# Altium schematic sheet DDR_MIO_Banks.SchDoc
size A
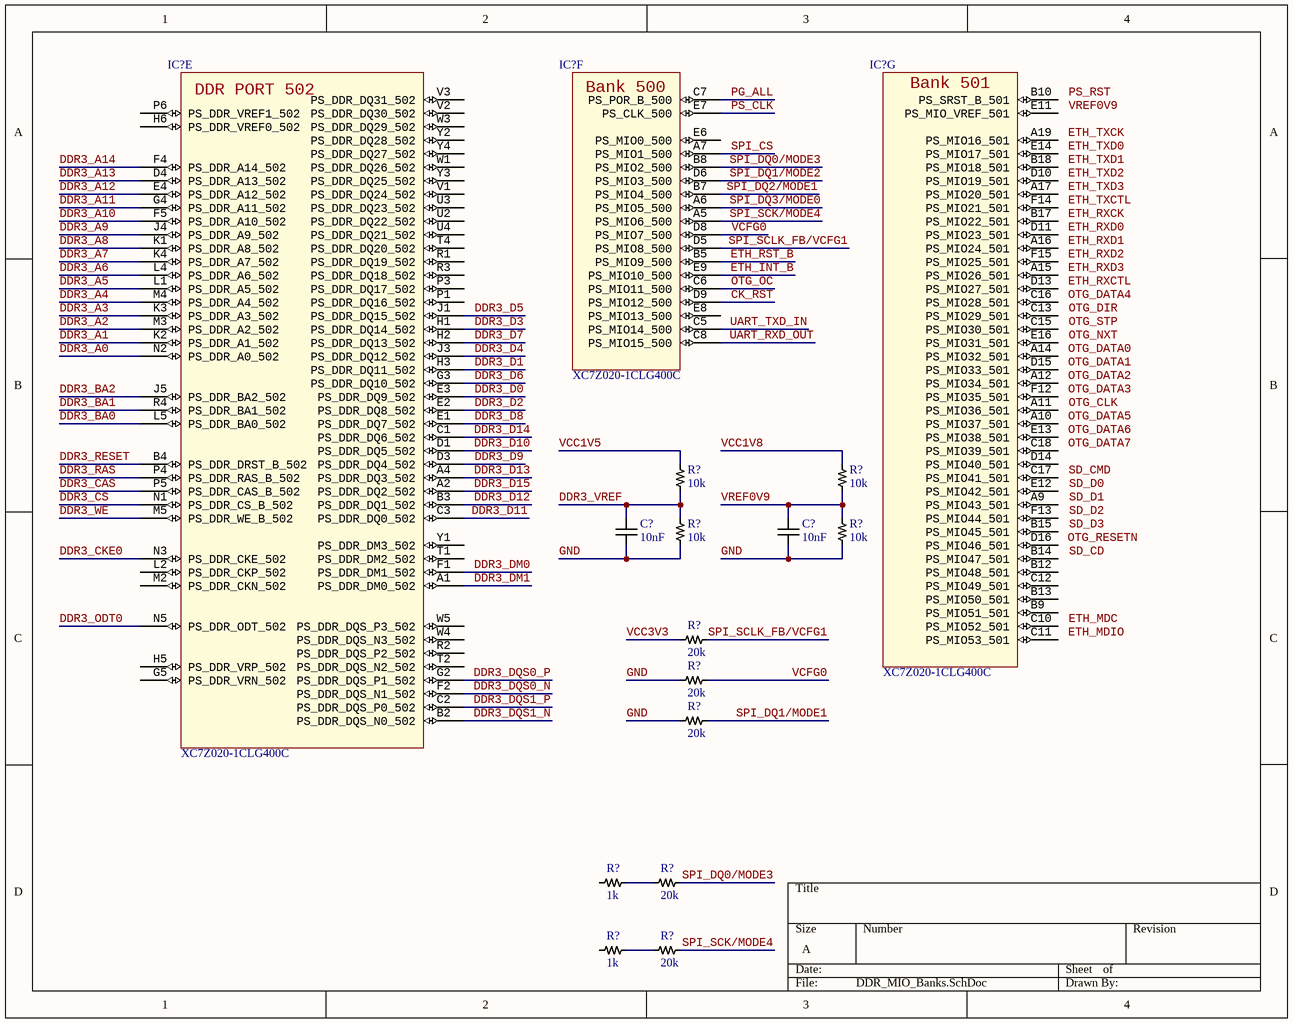
[diagram p0: DDR_MIO_Banks.SchDoc]

## Parts
(Parts that share a designator on the sheet are numbered #1, #2 ... from top to bottom, then left to right.)
C?#1  10nF  [CAP0402]
C?#2  10nF  [CAP0402]
IC?#1  XC7Z020-1CLG400C  [BGA400]  (part F of 9)
IC?#2  XC7Z020-1CLG400C  [BGA400]  (part G of 9)
IC?#3  XC7Z020-1CLG400C  [BGA400]  (part E of 9)
R?#1  10k  [RES0402]
R?#2  10k  [RES0402]
R?#3  10k  [RES0402]
R?#4  10k  [RES0402]
R?#5  20k  [RES0402]
R?#6  20k  [RES0402]
R?#7  20k  [RES0402]
R?#8  1k  [RES0402]
R?#9  20k  [RES0402]
R?#10  1k  [RES0402]
R?#11  20k  [RES0402]

## Nets
CK_RST: IC?#1.D9(PS_MIO12_500)
DDR3_A0: IC?#3.N2(PS_DDR_A0_502)
DDR3_A1: IC?#3.K2(PS_DDR_A1_502)
DDR3_A2: IC?#3.M3(PS_DDR_A2_502)
DDR3_A3: IC?#3.K3(PS_DDR_A3_502)
DDR3_A4: IC?#3.M4(PS_DDR_A4_502)
DDR3_A5: IC?#3.L1(PS_DDR_A5_502)
DDR3_A6: IC?#3.L4(PS_DDR_A6_502)
DDR3_A7: IC?#3.K4(PS_DDR_A7_502)
DDR3_A8: IC?#3.K1(PS_DDR_A8_502)
DDR3_A9: IC?#3.J4(PS_DDR_A9_502)
DDR3_A10: IC?#3.F5(PS_DDR_A10_502)
DDR3_A11: IC?#3.G4(PS_DDR_A11_502)
DDR3_A12: IC?#3.E4(PS_DDR_A12_502)
DDR3_A13: IC?#3.D4(PS_DDR_A13_502)
DDR3_A14: IC?#3.F4(PS_DDR_A14_502)
DDR3_BA0: IC?#3.L5(PS_DDR_BA0_502)
DDR3_BA1: IC?#3.R4(PS_DDR_BA1_502)
DDR3_BA2: IC?#3.J5(PS_DDR_BA2_502)
DDR3_CAS: IC?#3.P5(PS_DDR_CAS_B_502)
DDR3_CKE0: IC?#3.N3(PS_DDR_CKE_502)
DDR3_CS: IC?#3.N1(PS_DDR_CS_B_502)
DDR3_D0: IC?#3.E3(PS_DDR_DQ9_502)
DDR3_D1: IC?#3.H3(PS_DDR_DQ11_502)
DDR3_D2: IC?#3.E2(PS_DDR_DQ8_502)
DDR3_D3: IC?#3.H1(PS_DDR_DQ14_502)
DDR3_D4: IC?#3.J3(PS_DDR_DQ12_502)
DDR3_D5: IC?#3.J1(PS_DDR_DQ15_502)
DDR3_D6: IC?#3.G3(PS_DDR_DQ10_502)
DDR3_D7: IC?#3.H2(PS_DDR_DQ13_502)
DDR3_D8: IC?#3.E1(PS_DDR_DQ7_502)
DDR3_D9: IC?#3.D3(PS_DDR_DQ4_502)
DDR3_D10: IC?#3.D1(PS_DDR_DQ5_502)
DDR3_D11: IC?#3.C3(PS_DDR_DQ0_502)
DDR3_D12: IC?#3.B3(PS_DDR_DQ1_502)
DDR3_D13: IC?#3.A4(PS_DDR_DQ3_502)
DDR3_D14: IC?#3.C1(PS_DDR_DQ6_502)
DDR3_D15: IC?#3.A2(PS_DDR_DQ2_502)
DDR3_DM0: IC?#3.F1(PS_DDR_DM1_502)
DDR3_DM1: IC?#3.A1(PS_DDR_DM0_502)
DDR3_DQS0_N: IC?#3.F2(PS_DDR_DQS_N1_502)
DDR3_DQS0_P: IC?#3.G2(PS_DDR_DQS_P1_502)
DDR3_DQS1_N: IC?#3.B2(PS_DDR_DQS_N0_502)
DDR3_DQS1_P: IC?#3.C2(PS_DDR_DQS_P0_502)
DDR3_ODT0: IC?#3.N5(PS_DDR_ODT_502)
DDR3_RAS: IC?#3.P4(PS_DDR_RAS_B_502)
DDR3_RESET: IC?#3.B4(PS_DDR_DRST_B_502)
DDR3_VREF: C?#1.1 R?#1.1 R?#3.2
DDR3_WE: IC?#3.M5(PS_DDR_WE_B_502)
ETH_INT_B: IC?#1.E9(PS_MIO10_500)
ETH_RST_B: IC?#1.B5(PS_MIO9_500)
GND: C?#1.2 C?#2.2 R?#3.1 R?#4.1 R?#6.1 R?#7.1
OTG_OC: IC?#1.C6(PS_MIO11_500)
PG_ALL: IC?#1.C7(PS_POR_B_500)
PS_CLK: IC?#1.E7(PS_CLK_500)
SPI_CS: IC?#1.A7(PS_MIO1_500)
SPI_DQ0/MODE3: IC?#1.B8(PS_MIO2_500) R?#9.2
SPI_DQ1/MODE1: R?#7.2
SPI_DQ1/MODE2: IC?#1.D6(PS_MIO3_500)
SPI_DQ2/MODE1: IC?#1.B7(PS_MIO4_500)
SPI_DQ3/MODE0: IC?#1.A6(PS_MIO5_500)
SPI_SCK/MODE4: IC?#1.A5(PS_MIO6_500) R?#11.2
SPI_SCLK_FB/VCFG1: IC?#1.D5(PS_MIO8_500) R?#5.2
UART_RXD_OUT: IC?#1.C8(PS_MIO15_500)
UART_TXD_IN: IC?#1.C5(PS_MIO14_500)
VCC1V5: R?#1.2
VCC1V8: R?#2.2
VCC3V3: R?#5.1
VCFG0: IC?#1.D8(PS_MIO7_500) R?#6.2
VREF0V9: C?#2.1 R?#2.1 R?#4.2
NetR?#8_2: R?#8.2 R?#9.1
NetR?#10_2: R?#10.2 R?#11.1

Not connected (* = marked no-connect by the designer): IC?#1 E6(PS_MIO0_500) E8(PS_MIO13_500); IC?#2 A9(PS_MIO43_501) A10(PS_MIO37_501) A11(PS_MIO36_501) A12(PS_MIO34_501) A14(PS_MIO32_501) A15(PS_MIO26_501) A16(PS_MIO24_501) A17(PS_MIO20_501) A19(PS_MIO16_501) B9(PS_MIO51_501) B10(PS_SRST_B_501) B12(PS_MIO48_501) B13(PS_MIO50_501) B14(PS_MIO47_501) B15(PS_MIO45_501) B17(PS_MIO22_501) B18(PS_MIO18_501) C10(PS_MIO52_501) C11(PS_MIO53_501) C12(PS_MIO49_501) C13(PS_MIO29_501) C15(PS_MIO30_501) C16(PS_MIO28_501) C17(PS_MIO41_501) C18(PS_MIO39_501) D10(PS_MIO19_501) D11(PS_MIO23_501) D13(PS_MIO27_501) D14(PS_MIO40_501) D15(PS_MIO33_501) D16(PS_MIO46_501) E11(PS_MIO_VREF_501) E12(PS_MIO42_501) E13(PS_MIO38_501) E14(PS_MIO17_501) E16(PS_MIO31_501) F12(PS_MIO35_501) F13(PS_MIO44_501) F14(PS_MIO21_501) F15(PS_MIO25_501); IC?#3 G5(PS_DDR_VRN_502) H5(PS_DDR_VRP_502) H6(PS_DDR_VREF0_502) L2(PS_DDR_CKP_502) M2(PS_DDR_CKN_502) P1(PS_DDR_DQ16_502) P3(PS_DDR_DQ17_502) P6(PS_DDR_VREF1_502) R1(PS_DDR_DQ19_502) R2(PS_DDR_DQS_P2_502) R3(PS_DDR_DQ18_502) T1(PS_DDR_DM2_502) T2(PS_DDR_DQS_N2_502) T4(PS_DDR_DQ20_502) U2(PS_DDR_DQ22_502) U3(PS_DDR_DQ23_502) U4(PS_DDR_DQ21_502) V1(PS_DDR_DQ24_502) V2(PS_DDR_DQ30_502) V3(PS_DDR_DQ31_502) W1(PS_DDR_DQ26_502) W3(PS_DDR_DQ29_502) W4(PS_DDR_DQS_N3_502) W5(PS_DDR_DQS_P3_502) Y1(PS_DDR_DM3_502) Y2(PS_DDR_DQ28_502) Y3(PS_DDR_DQ25_502) Y4(PS_DDR_DQ27_502); R?#8 1; R?#10 1

## Notes on the sheet
- Labels drawn without touching a wire or pin: ETH_MDC, ETH_MDIO, ETH_RXCK, ETH_RXCTL, ETH_RXD0, ETH_RXD1, ETH_RXD2, ETH_RXD3, ETH_TXCK, ETH_TXCTL, ETH_TXD0, ETH_TXD1, ETH_TXD2, ETH_TXD3, OTG_CLK, OTG_DATA0, OTG_DATA1, OTG_DATA2, OTG_DATA3, OTG_DATA4, OTG_DATA5, OTG_DATA6, OTG_DATA7, OTG_DIR, OTG_NXT, OTG_RESETN, OTG_STP, PS_RST, SD_CD, SD_CMD, SD_D0, SD_D1, SD_D2, SD_D3, VREF0V9
- (in symbol XC7Z020-1CLG400C, part E) DDR PORT 502
- (in symbol XC7Z020-1CLG400C, part F) Bank 500
- (in symbol XC7Z020-1CLG400C, part G) Bank 501

## Library data of the parts
C?#1 C?#2 = GRM155R71H103KA88D: MLCC 10nF 0402 SMD; Manufacturer: Murata; Material: Ceramic; Tolerance: 10%; Voltage Rating: 50V; Dielectric: X7R; Voltage: 25V; Supplier 1: Digi-Key; Manufacturer Part Number: GRM155R71H103KA88D; Stock 1: 7384657; Pricing 1: 1=0.10000, 10=0.03800, 100=0.01690, 500=0.01208, 1000=0.00949, 2500=0.00862, 5000=0.00794 (USD); RoHS: Yes; Mount: Surface Mount; Case/Package: 0402; Number of Pins: 2; Case Code (Metric): 1005; Case Code (Imperial): 0402; Min Operating Temperature: -55°C; Max Operating Temperature: 125°C; Packaging: Tape and Reel; Package Quantity: 1; Termination: SMD/SMT; Capacitance: 10nF; Voltage Rating (DC): 50V; Length: 1mm; Height: 0.5mm; Width: 0.02inch; Thickness: 0.022inch; Depth: 0.5mm; Radiation Hardening: No; REACH SVHC: No SVHC; Lead Free: Lead Free; ComponentLink1URL: https://datasheet.ciiva.com/129/product-129810.pdf?src-supplier=Digi-Key; ComponentLink1Description: https://datasheet.ciiva.com/129/product-129810.pdf?src-supplier=Digi-Key; ComponentLink2URL: https://datasheet.ciiva.com/19476/1856433-19476546.pdf?src-supplier=Jameco; ComponentLink2Description: https://datasheet.ciiva.com/19476/1856433-19476546.pdf?src-supplier=Jameco; ComponentLink3URL: https://datasheet.ciiva.com/11786/0900766b80ef921d-11786340.pdf?src-supplier=RSComponents; ComponentLink3Description: https://datasheet.ciiva.com/11786/0900766b80ef921d-11786340.pdf?src-supplier=RSComponents; ComponentLink4URL: https://datasheet.ciiva.com/18100/getdatasheetpartid-27434-18100660.pdf?src-supplier=Verical; ComponentLink4Description: https://datasheet.ciiva.com/18100/getdatasheetpartid-27434-18100660.pdf?src-supplier=Verical; ComponentLink5URL: https://datasheet.ciiva.com/22698/1747449-22698420.pdf?src-supplier=Element14; ComponentLink5Description: https://datasheet.ciiva.com/22698/1747449-22698420.pdf?src-supplier=Element14; ComponentLink6URL: https://datasheet.ciiva.com/29199/454225-da-01-en-vs-kondensator-0402-29199740.pdf?src-supplier=Conrad; ComponentLink6Description: https://datasheet.ciiva.com/29199/454225-da-01-en-vs-kondensator-0402-29199740.pdf?src-supplier=Conrad; ComponentLink7URL: https://datasheet.ciiva.com/129/grm155r71h103ka88-01-129811.pdf?src-supplier=Digi-Key; ComponentLink7Description: https://datasheet.ciiva.com/129/grm155r71h103ka88-01-129811.pdf?src-supplier=Digi-Key; ComponentLink8URL: https://datasheet.ciiva.com/129/grm155r71h103ka88-01-129812.pdf?src-supplier=Digi-Key; ComponentLink8Description: https://datasheet.ciiva.com/129/grm155r71h103ka88-01-129812.pdf?src-supplier=Digi-Key; ComponentLink9URL: https://datasheet.ciiva.com/16495/product-16495290.pdf?src-supplier=Future+Electronics; ComponentLink9Description: https://datasheet.ciiva.com/16495/product-16495290.pdf?src-supplier=Future+Electronics; ComponentLink10URL: https://datasheet.ciiva.com/5410/product-5410990.pdf?src-supplier=Mouser; ComponentLink10Description: https://datasheet.ciiva.com/5410/product-5410990.pdf?src-supplier=Mouser
IC?#1-IC?#3 = XC7Z020-1CLG400C: Zynq-7000 SoC.; ComponentLink1Description: Digi-Key; ComponentLink1URL: https://www.digikey.com/product-detail/en/xilinx-inc/XC7Z020-1CLG400C/122-1851-ND/3925758?utm_adgroup=Integrated Circuits&slid=&gclid=Cj0KCQjwn_LrBRD4ARIsAFEQFKtYXIOPieaS_xsLL2AvFALkVw3M5siD0KQOWM0owpA_yiQuHKATBqcaAuQ6EALw_wcB
R?#1-R?#4 = RC0402FR-0710KL: Resistor 10kOhm 0402 SMD; Manufacturer: Yageo; Resistance: 10kR; Tolerance: 1%; Temperature Coefficient: 100ppm/°C; Voltage Rating: 50V; Power Rating: 62.5mW; Supplier 1: Digi-Key; Manufacturer Part Number: RC0402FR-0710KL; Stock 1: 78932647; Pricing 1: 1=0.10000, 10=0.01500, 100=0.00630, 1000=0.00281, 2500=0.00244, 5000=0.00201 (USD); RoHS: Yes; Case/Package: 0402; Number of Pins: 2; Case Code (Imperial): 0402; Case Code (Metric): 1005; Min Operating Temperature: -55°C; Max Operating Temperature: 155°C; Packaging: Tape and Reel; Composition: Thick Film; Voltage Rating (DC): 50V; Termination: SMD/SMT; Military Standard: Not; Working Voltage: 50V; Number of Terminations: 2; Length: 1mm; Height: 0.32mm; Width: 0.5mm; Depth: 0.5mm; Lead Pitch: 0.2mm; REACH SVHC: No SVHC; Lead Free: Lead Free; ComponentLink1URL: https://datasheet.ciiva.com/7660/38568-7660787.pdf?src-supplier=Element14; ComponentLink1Description: https://datasheet.ciiva.com/7660/38568-7660787.pdf?src-supplier=Element14; ComponentLink2URL: https://datasheet.ciiva.com/7983/1018594-7983486.pdf?src-supplier=Element14; ComponentLink2Description: https://datasheet.ciiva.com/7983/1018594-7983486.pdf?src-supplier=Element14; ComponentLink3URL: https://datasheet.ciiva.com/7849/1784430-7849813.pdf?src-supplier=Element14; ComponentLink3Description: https://datasheet.ciiva.com/7849/1784430-7849813.pdf?src-supplier=Element14; ComponentLink4URL: https://datasheet.ciiva.com/7849/1686128-7849814.pdf?src-supplier=Element14; ComponentLink4Description: https://datasheet.ciiva.com/7849/1686128-7849814.pdf?src-supplier=Element14; ComponentLink5URL: https://datasheet.ciiva.com/7849/1784430-7849815.pdf?src-supplier=Element14; ComponentLink5Description: https://datasheet.ciiva.com/7849/1784430-7849815.pdf?src-supplier=Element14; ComponentLink6URL: https://datasheet.ciiva.com/22747/1018594-22747512.pdf?src-supplier=Element14; ComponentLink6Description: https://datasheet.ciiva.com/22747/1018594-22747512.pdf?src-supplier=Element14; ComponentLink7URL: https://datasheet.ciiva.com/12667/pyu-rc0402-51-rohs-l-6-r-12667067.pdf?src-supplier=Mouser; ComponentLink7Description: https://datasheet.ciiva.com/12667/pyu-rc0402-51-rohs-l-6-r-12667067.pdf?src-supplier=Mouser
R?#5-R?#7 R?#9 R?#11 = RC0402FR-0720KL: Resistor 20kOhm 0402 SMD; Manufacturer: Yageo; Tolerance: 1%; Resistance: 20kR; Power Rating: 62.5mW; Voltage Rating: 50V; Temperature Coefficient: 100ppm/°C; Max Power Dissipation: 63mW; Supplier 1: Digi-Key; Manufacturer Part Number: RC0402FR-0720KL; Stock 1: 5271703; Pricing 1: 1=0.10000, 10=0.01600, 100=0.00670, 1000=0.00301, 2500=0.00261, 5000=0.00215 (USD); RoHS: Yes; Case/Package: 0402; Number of Pins: 2; Case Code (Metric): 1005; Case Code (Imperial): 0402; Min Operating Temperature: -55°C; Max Operating Temperature: 155°C; Package Quantity: 1; Packaging: Tape and Reel; Composition: Thick Film; Number of Terminations: 2; Termination: SMD/SMT; Military Standard: Not; Voltage Rating (DC): 50V; Features: Moisture Resistant; Length: 1mm; Height: 0.016inch; Width: 0.02inch; Depth: 0.5mm; REACH SVHC: No SVHC; Lead Free: Lead Free; ComponentLink1URL: https://datasheet.ciiva.com/11808/0900766b80c66297-11808454.pdf?src-supplier=RSComponents; ComponentLink1Description: https://datasheet.ciiva.com/11808/0900766b80c66297-11808454.pdf?src-supplier=RSComponents; ComponentLink2URL: https://datasheet.ciiva.com/2453/pyu-r-int-thick-7-2453493.pdf?src-supplier=Digi-Key; ComponentLink2Description: https://datasheet.ciiva.com/2453/pyu-r-int-thick-7-2453493.pdf?src-supplier=Digi-Key; ComponentLink3URL: https://datasheet.ciiva.com/2453/pyu-r-int-thick-7-2453494.pdf?src-supplier=Digi-Key; ComponentLink3Description: https://datasheet.ciiva.com/2453/pyu-r-int-thick-7-2453494.pdf?src-supplier=Digi-Key; ComponentLink4URL: https://datasheet.ciiva.com/2453/pyu-r-int-thick-7-2453495.pdf?src-supplier=Digi-Key; ComponentLink4Description: https://datasheet.ciiva.com/2453/pyu-r-int-thick-7-2453495.pdf?src-supplier=Digi-Key; ComponentLink5URL: https://datasheet.ciiva.com/7983/1018594-7983511.pdf?src-supplier=Element14; ComponentLink5Description: https://datasheet.ciiva.com/7983/1018594-7983511.pdf?src-supplier=Element14; ComponentLink6URL: https://datasheet.ciiva.com/12558/pyu-rc0402-51-rohs-l-6-r-8721-12558796.pdf?src-supplier=Mouser; ComponentLink6Description: https://datasheet.ciiva.com/12558/pyu-rc0402-51-rohs-l-6-r-8721-12558796.pdf?src-supplier=Mouser; ComponentLink7URL: https://datasheet.ciiva.com/46394/1018594-46394974.pdf?src-supplier=Element14; ComponentLink7Description: https://datasheet.ciiva.com/46394/1018594-46394974.pdf?src-supplier=Element14
R?#8 R?#10 = RC0402FR-071KL: Resistor 1kOhm 0402 SMD; Manufacturer: Yageo; Tolerance: 1%; Resistance: 1kR; Temperature Coefficient: 100ppm/°C; Voltage Rating (DC): 50V; Power Rating: 62.5mW; Supplier 1: Digi-Key; Manufacturer Part Number: RC0402FR-071KL; Stock 1: 60632232; Pricing 1: 1=0.10000, 10=0.01600, 100=0.00670, 1000=0.00301, 2500=0.00261, 5000=0.00215 (USD); RoHS: Yes; Case/Package: 0402; Number of Pins: 2; Case Code (Imperial): 0402; Case Code (Metric): 1005; Min Operating Temperature: -55°C; Max Operating Temperature: 155°C; Composition: Thick Film; Packaging: Tape and Reel; Voltage Rating: 50V; Termination: SMD/SMT; Military Standard: Not; Length: 1mm; Height: 0.32mm; Width: 0.5mm; Depth: 0.5mm; REACH SVHC: Unknown; Lead Free: Lead Free; ComponentLink1URL: https://datasheet.ciiva.com/11819/0900766b80c66297-11819477.pdf?src-supplier=RSComponents; ComponentLink1Description: https://datasheet.ciiva.com/11819/0900766b80c66297-11819477.pdf?src-supplier=RSComponents; ComponentLink2URL: https://datasheet.ciiva.com/12666/pyu-rc0402-51-rohs-l-6-r-12666741.pdf?src-supplier=Mouser; ComponentLink2Description: https://datasheet.ciiva.com/12666/pyu-rc0402-51-rohs-l-6-r-12666741.pdf?src-supplier=Mouser; ComponentLink3URL: https://datasheet.ciiva.com/17063/pyu-rc0402-51-rohs-l-6-r-17063193.pdf?src-supplier=Future+Electronics; ComponentLink3Description: https://datasheet.ciiva.com/17063/pyu-rc0402-51-rohs-l-6-r-17063193.pdf?src-supplier=Future+Electronics; ComponentLink4URL: https://datasheet.ciiva.com/22747/1018594-22747513.pdf?src-supplier=Element14; ComponentLink4Description: https://datasheet.ciiva.com/22747/1018594-22747513.pdf?src-supplier=Element14; ComponentLink5URL: https://datasheet.ciiva.com/7849/1018594-7849869.pdf?src-supplier=Element14; ComponentLink5Description: https://datasheet.ciiva.com/7849/1018594-7849869.pdf?src-supplier=Element14; ComponentLink6URL: https://datasheet.ciiva.com/7983/1018594-7983502.pdf?src-supplier=Element14; ComponentLink6Description: https://datasheet.ciiva.com/7983/1018594-7983502.pdf?src-supplier=Element14; ComponentLink7URL: https://datasheet.ciiva.com/7849/1018594-7849871.pdf?src-supplier=Element14; ComponentLink7Description: https://datasheet.ciiva.com/7849/1018594-7849871.pdf?src-supplier=Element14